# Altium schematic sheet supply_unit.SchDoc: Модуль питания РМ
size 420 x 297 mm; Date: 2019-11-22; ApprovedBy: Мельников; CheckedBy: Соколов; CompanyName: Диаконт; DrawnBy: Тихонов; DocumentNumber: ЭИТЦЯ.436434.018 Э3; Revision: A; SheetTotal: 1; DocumentType: Схема электрическая принципиальная; Liter: Э; PageSetup: Record=PageOptions|CenterHorizontal=True|CenterVertical=True|PrintScale=0.96|XCorrection=1.00|YCorrection=1.00|PrintKind=1|BorderSize=5000000|LeftOffset=0|BottomOffset=0|Orientation=2|PaperLength=1000|PaperWidth=1000|Scale=100|PaperSource=7|PrintQuality=-4|MediaType=1|DitherType=10|PaperKind=A3|PrintScaleMode=1; FirstApp: ЭИТЦЯ.436434.018; Language: en; ResponsibleDept: DED; DocumentStatus: Released; DecimalNumber: {DecimalNumber}
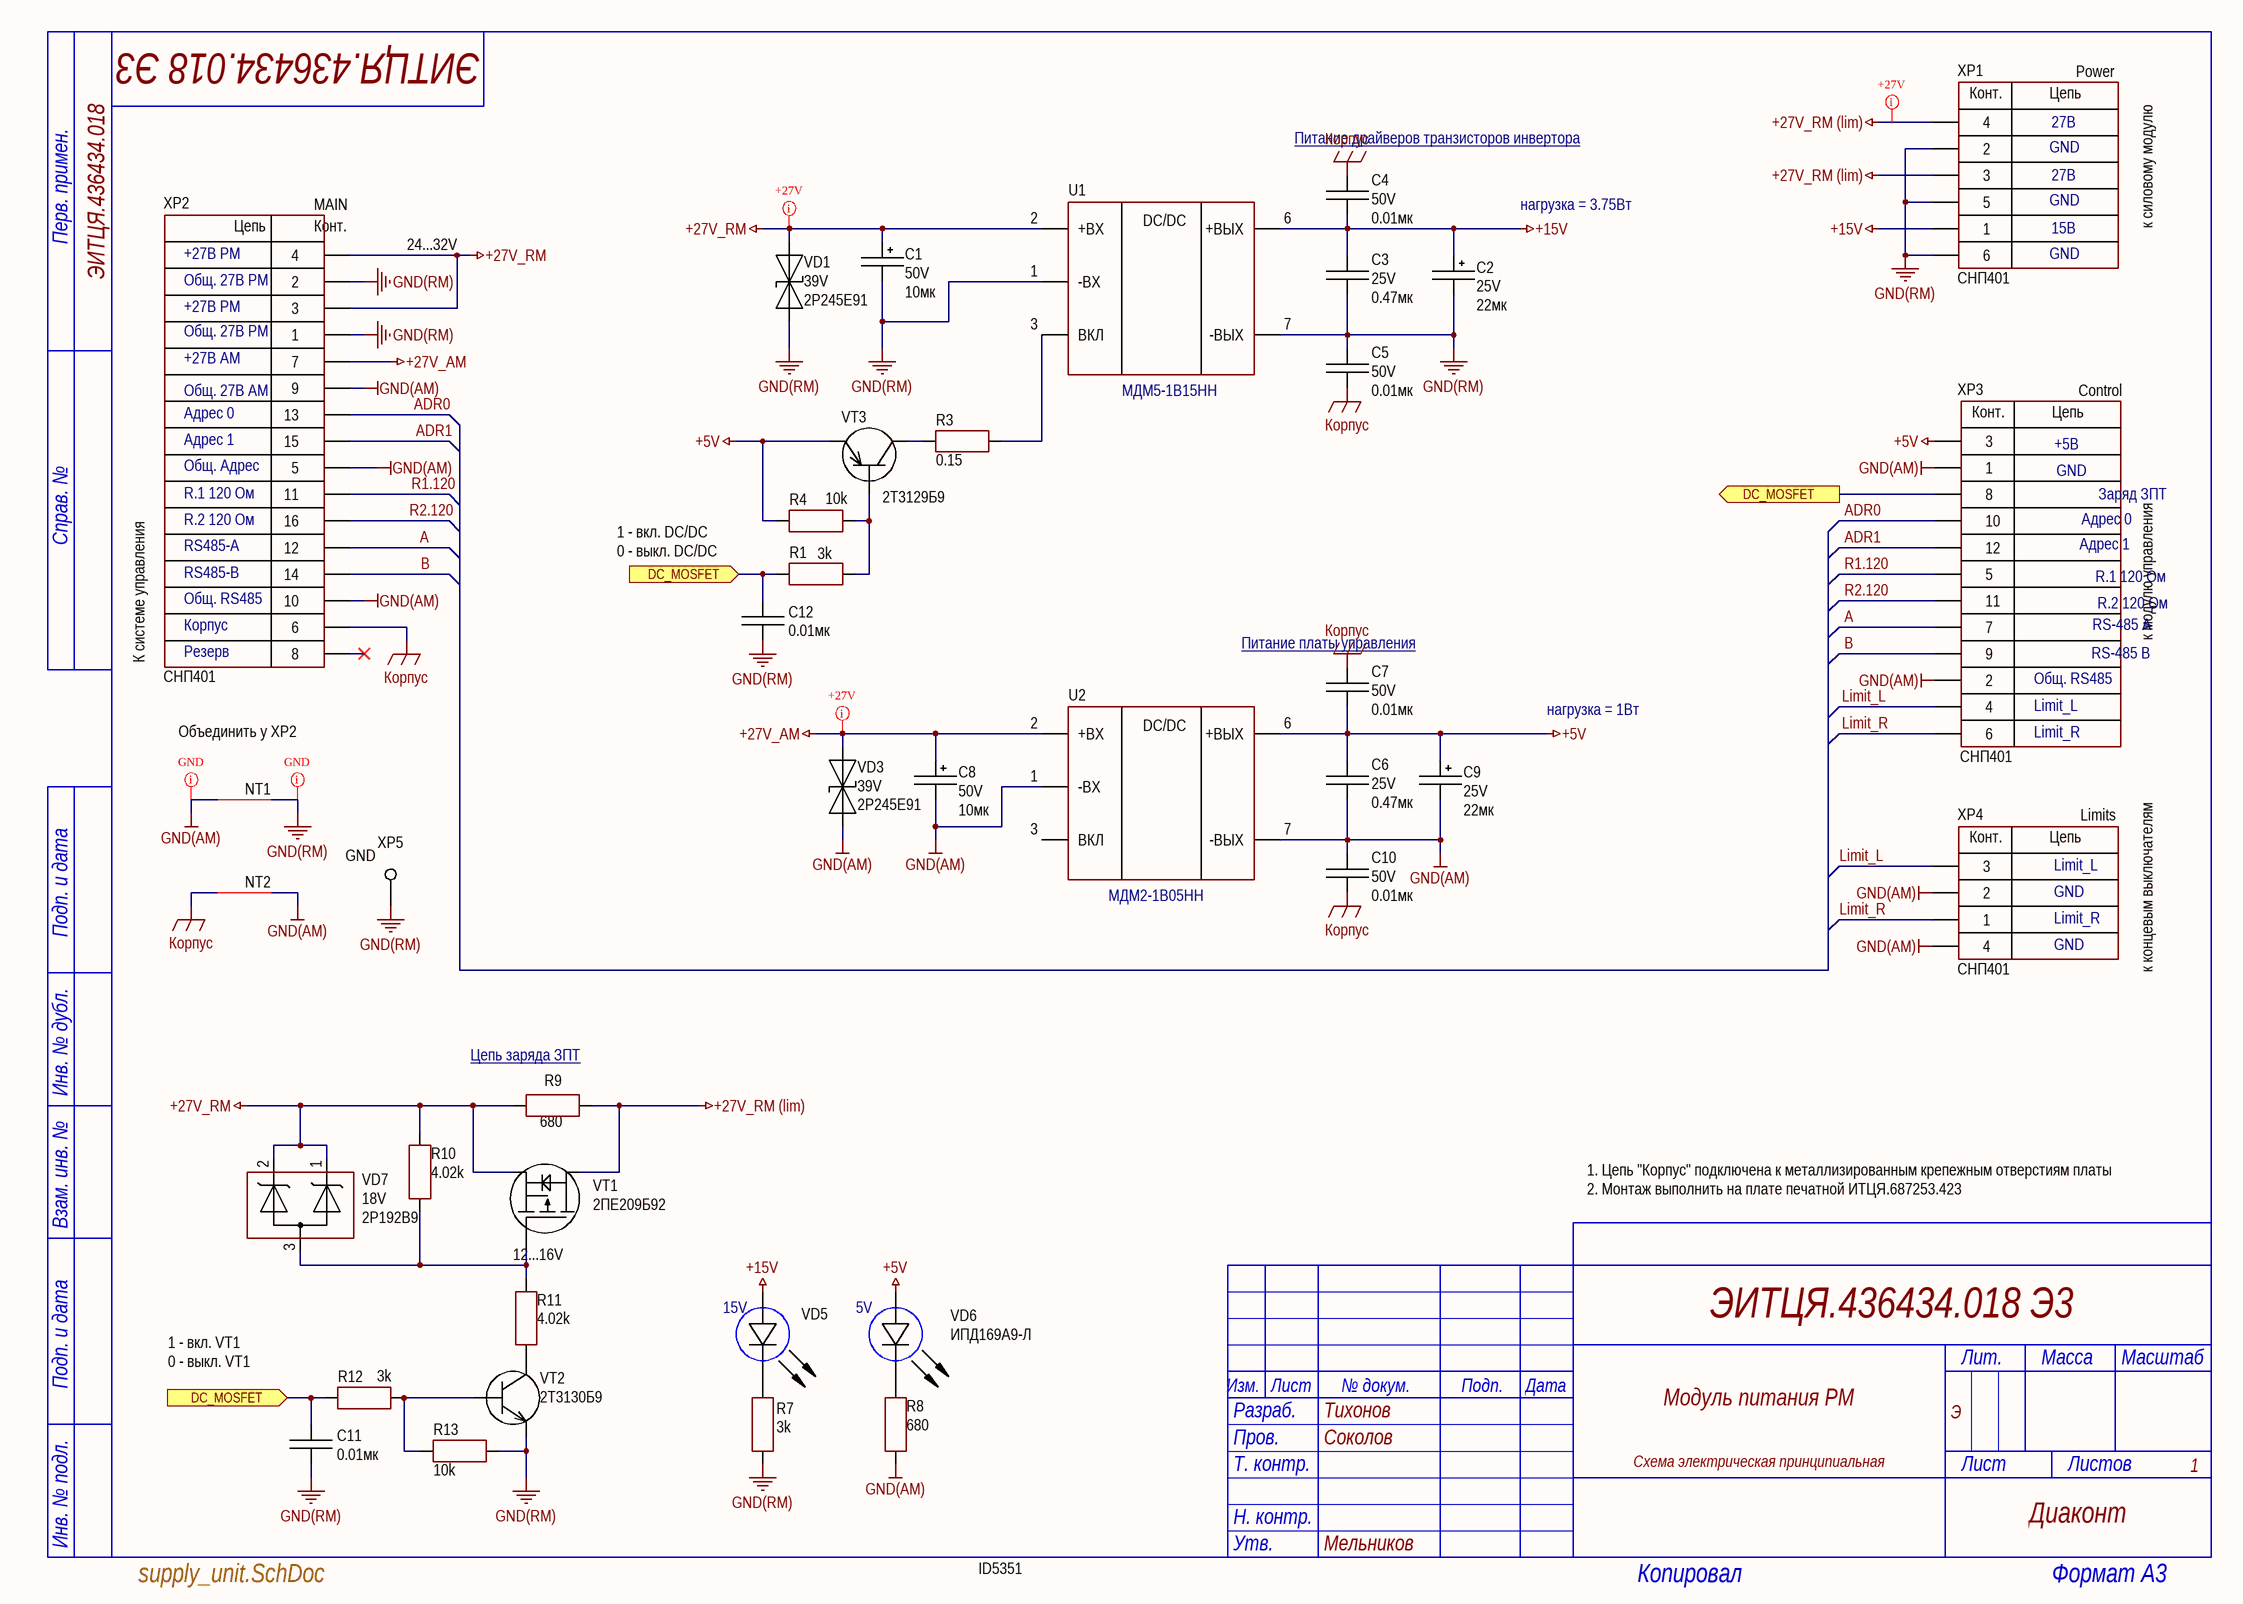
[diagram p0: supply_unit.SchDoc]

## Parts
C1  value 10мк  Voltage: 50V  [CAP: TANTAL-E]  (hidden comment: Tantalum capacitor, 10мк, 50V, ±10%, 0.7 Ом, case E, -60...+125°C)
C2  value 22мк  Voltage: 25V  [CAP: TANTAL-D]  (hidden comment: Tantalum capacitor, 22мк, 25V, ±10%, 0.7 Ом, case D, -60...+125°C)
C3  value 0.47мк  Voltage: 25V  [CAP: 1210]
C4  value 0.01мк  Voltage: 50V  [CAP: 0603]
C5  value 0.01мк  Voltage: 50V  [CAP: 0603]
C6  value 0.47мк  Voltage: 25V  [CAP: 1210]
C7  value 0.01мк  Voltage: 50V  [CAP: 0603]
C8  value 10мк  Voltage: 50V  [CAP: TANTAL-E]  (hidden comment: Tantalum capacitor, 10мк, 50V, ±10%, 0.7 Ом, case E, -60...+125°C)
C9  value 22мк  Voltage: 25V  [CAP: TANTAL-D]  (hidden comment: Tantalum capacitor, 22мк, 25V, ±10%, 0.7 Ом, case D, -60...+125°C)
C10  value 0.01мк  Voltage: 50V  [CAP: 0603]
C11  value 0.01мк  [CAP: 0603P]
C12  value 0.01мк  [CAP: 0603P]
NT1  (no value)  [NetTie_0805]  (net tie, no BOM)
NT2  (no value)  [NetTie_0603]  (net tie, no BOM)
R1  value 3k  [RES: 0603P]
R3  value 0.15  [RES: 0603P]
R4  value 10k  [RES: 0603P]
R7  value 3k  [RES: 0603P]
R8  value 680  [RES: 0603P]
R9  value 680  [RES: 0805P]
R10  value 4.02k  [RES: 0805P]
R11  value 4.02k  [RES: 0805P]
R12  value 3k  [RES: 0603P]
R13  value 10k  [RES: 0603P]
U1  CommentText: МДМ5-1В15НН  [SIP-8]
U2  CommentText: МДМ2-1В05НН  [SIP-8]
VD1  Voltage: 39V  PartNumber: 2Р245Е91  [DIODE: SMB]
VD3  Voltage: 39V  PartNumber: 2Р245Е91  [DIODE: SMB]
VD5  CommentText: 15V  [LED: 0603G]
VD6  PartNumber: ИПД169А9-Л  CommentText: 5V  [LED: 0603G]
VD7  Voltage: 18V  PartNumber: 2Р192В9  [SOT23]
VT1  PartNumber: 2ПЕ209Б92  [DPAK]
VT2  PartNumber: 2Т3130Б9  [SOT23]
VT3  PartNumber: 2Т3129Б9  [SOT23]
XP1  CommentText: СНП401  [CON: M80-5000605]
XP2  CommentText: СНП401  [CON: M80-5001605]
XP3  CommentText: СНП401  [CON: M80-5001205]
XP4  CommentText: СНП401  [CON: M80-5000405]
XP5  GND  [CON: PLS2-1]  (value not drawn)

## Ports
DC_MOSFET (in), DC_MOSFET (out)

## Nets
+5V: C6.2 C7.1 C9.1 R4.1 U2.6(+ВЫХ) VD6.1(A) VT3.2(E) XP3.3
+15V: C2.1 C3.2 C4.1 U1.6(+ВЫХ) VD5.1(A) XP1.1
+27V_AM: C8.1 U2.2(+ВХ) VD3.2(C) XP2.7
+27V_RM: C1.1 R9.1 R10.1 U1.2(+ВХ) VD1.2(C) VD7.1(K1) VD7.2(K2) VT1.2(S) XP2.3 XP2.4
+27V_RM (lim): R9.2 VT1.3(D) XP1.3 XP1.4
GND(AM): C6.1 C8.2 C9.2 C10.2 NT1.1 NT2.2 R8.2 U2.1(-ВХ) U2.7(-ВЫХ) VD3.1(A) XP2.5 XP2.9 XP2.10 XP3.1 XP3.2 XP4.2 XP4.4
GND(RM): C1.2 C2.2 C3.1 C5.2 C11.2 C12.2 NT1.2 R7.1 R13.1 U1.1(-ВХ) U1.7(-ВЫХ) VD1.1(A) VT2.2(E) XP1.2 XP1.5 XP1.6 XP2.1 XP2.2 XP5.1
Корпус: C4.2 C5.1 C7.2 C10.1 NT2.1 XP2.6
A: XP2.12 XP3.7
ADR0: XP2.13 XP3.10
ADR1: XP2.15 XP3.12
B: XP2.14 XP3.9
DC_MOSFET: C11.1 C12.1 R1.2 R12.1 XP3.8 ; port DC_MOSFET
Limit_L: XP3.4 XP4.3
Limit_R: XP3.6 XP4.1
R1.120: XP2.11 XP3.5
R2.120: XP2.16 XP3.11
NetR1_1: R1.1 R4.2 VT3.1(B)
NetR3_1: R3.1 VT3.3(C)
NetR3_2: R3.2 U1.3(ВКЛ)
NetR7_2: R7.2 VD5.2(C)
NetR8_1: R8.1 VD6.2(C)
NetR10_2: R10.2 R11.1 VD7.3(A) VT1.1(G)
NetR11_2: R11.2 VT2.3(C)
NetR12_2: R12.2 R13.2 VT2.1(B)

Not connected (* = marked no-connect by the designer): U2 3(ВКЛ); XP2 8*

## Layout directives
net class +27V: +27V_AM, +27V_RM, +27V_RM (lim)
net class GND: GND(AM), GND(RM)

## Notes on the sheet
- 27В
- Power
- Питание драйверов транзисторов инвертора
- GND
- +27В РМ
- (near XP2) MAIN
- (near XP2) 24...32V
- (near C4) нагрузка = 3.75Вт
- 15В
- к силовому модулю
- (near XP2) Общ. 27В РМ
- (near XP2) Общ. 27В АМ
- +27В АМ
- Control
- Адрес 0
- Адрес 1
- +5В
- К системе управления
- R.1 120 Ом
- R.2 120 Ом
- Общ. Адрес
- Заряд ЗПТ
- RS485-A
- RS485-B
- 1 - вкл. DC/DC
  0 - выкл. DC/DC
- (near XP3) R.1 120 Ом
- Общ. RS485
- Корпус
- Резерв
- Питание платы управления
- RS-485 B
- RS-485 A
- (near XP3) R.2 120 Ом
- к модулю управления
- нагрузка = 1Вт
- Limit_L
- Объединить у XP2
- Limit_R
- (near XP5) GND
- Limits
- к концевым выключателям
- Цепь заряда ЗПТ
- (near VT1) 12...16V
- 1. Цепь "Корпус" подключена к металлизированным крепежным отверстиям платы
  2. Монтаж выполнить на плате печатной ИТЦЯ.687253.423
- 1 - вкл. VT1
  0 - выкл. VT1
- ID5351
- Перв. примен.
- Справ. №
- Подп. и дата
- Инв. № дубл.
- Взам. инв. №
- Изм.
- Лист
- № докум.
- Подп.
- Дата
- Лит.
- Масса
- Масштаб
- Разраб.
- Пров.
- Т. контр.
- Листов
- Инв. № подл.
- Н. контр.
- Утв.
- Копировал
- Формат A3
- (in symbol M80-5000405 Harwin) Конт.; Цепь
- (in symbol M80-5000605 Harwin) Конт.; Цепь
- (in symbol M80-5001205 Harwin) Конт.; Цепь
- (in symbol M80-5001205 Harwin_1) Цепь; Конт.
- (in symbol МДМ3-1В09СН) DC/DC

## Library data of the parts
C1 C8 = Tantal_E: Manufacturer: Элеконд; PartNumber: К53-68 "E"-50 В-10мкф ±10%; Impedance: 0.7 Ом; Analog: 00132739 (pin-to-pin на 15мкФ); MAX: 00145440; Polarity: +; Package: case E; HelpURL: https://eandc.ru/pdf/kondensator/k53-68.pdf; ValueManufacturerPartNumber: Tantalum capacitor, 10мк, 50V, ±10%, 0.7 Ом, case E, -60...+125°C; Temperature: -60...+125°C; Tolerance: ±10%; TypeCapacitor: Tantalum capacitor
C2 C9 = Tantal_D: Manufacturer: Элеконд; PartNumber: К53-68 "D"-25 В-22мкф ±10%; Impedance: 0.7 Ом; MAX: 00132735; Package: case D; HelpURL: https://eandc.ru/pdf/kondensator/k53-68.pdf; ValueManufacturerPartNumber: Tantalum capacitor, 22мк, 25V, ±10%, 0.7 Ом, case D, -60...+125°C; Temperature: -60...+125°C; Tolerance: ±10%; TypeCapacitor: Tantalum capacitor
C3 C6 = Ceramic_0603: Manufacturer: Монолит; PartNumber: К10-84в-3225М-25В-0,47 мкФ ±10%-Н20-N-A; ValueManufacturerPartNumber: Ceramic capacitor, 0.47мк, Н20, ±10%, 25V, 1210 (3225М),; TypeCapacitor: Ceramic capacitor; Tolerance: ±10%; TypeDielectric: Н20; Analog: MAX 00150226; Package: 1210 (3225М); HelpURL: http://www.monolit.vitebsk.by/Files/K10-84.pdf
C4 C5 C7 C10 = Ceramic_0603: Manufacturer: Монолит; PartNumber: К10-84в-1608М-50В-0.01мк ±20%-Н20-N-A; ValueManufacturerPartNumber: Ceramic capacitor, 0.01мк, Н20, ±10%, 50V, 0603 (1608M), -55...+125°C; TypeCapacitor: Ceramic capacitor; Tolerance: ±10%; TypeDielectric: Н20; Package: 0603 (1608M); HelpURL: http://www.monolit.vitebsk.by/Files/K10-84.pdf; Temperature: -55...+125°C
C11 C12 = Ceramic_0603: Manufacturer: Монолит; PartNumber: К10-84в-1608М-50В-0.01мк ±20%-Н20-N-A; ValueManufacturerPartNumber: Ceramic capacitor, 0.01мк, H20, ±20%, 50V, 0603 (1608M), -55...+125°C; TypeCapacitor: Ceramic capacitor; Tolerance: ±20%; TypeDielectric: H20; Voltage: 50V; Analog: MAX 00131676 (pin-to-pin); Package: 0603 (1608M); HelpURL: http://www.monolit.vitebsk.by/Files/K10-84.pdf; Temperature: -55...+125°C
NT1 NT2 = NetTie
R1 R7 R12 = Resistor_0603: Manufacturer: ОАО Ресурс; PartNumber: Р1-12-0,1ум.-3~кОм ±5%-М ШКАБ.434110.002 ТУ; ValueManufacturerPartNumber: Resistor film, 3k, ±1%, 0603, 0.1W, -55...+125°C; TypeResistor: Resistor film; Power: 0.1W; Tolerance: ±1%; MAX: 00134036; Package: 0603; HelpURL: https://aoresurs.com/catalog/chip_rezistory/rezistory-r1-12-kategoriya-kachestva-vp-/; Temperature: -55...+125°C
R3 = Resistor_0603: Manufacturer: ОАО Ресурс; PartNumber: Р1-12-0,1ум.-0.15~Ом ±20%-М ШКАБ.434110.002 ТУ; ValueManufacturerPartNumber: Resistor film, 0.15, ±20%, 0603, 0.1W, -55...+125°C; TypeResistor: Resistor film; Power: 0.1W; Tolerance: ±20%; MAX: 00133968; Analog: MAX 00117169 pin-to-pin; Package: 0603; HelpURL: https://aoresurs.com/catalog/chip_rezistory/rezistory-r1-12-kategoriya-kachestva-vp-/; Temperature: -55...+125°C
R4 R13 = Resistor_0603: Manufacturer: ОАО Ресурс; PartNumber: Р1-12-0,1ум.-10~кОм ±5%-М ШКАБ.434110.002 ТУ; ValueManufacturerPartNumber: Resistor film, 10k, ±5%, 0603, 0.1W, -55...+125°C; TypeResistor: Resistor film; Power: 0.1W; Tolerance: ±5%; MAX: 00133985; Analog: MAX 00133986 (1%); Package: 0603; HelpURL: https://aoresurs.com/catalog/chip_rezistory/rezistory-r1-12-kategoriya-kachestva-vp-/; Temperature: -55...+125°C
R8 = Resistor_0603: Manufacturer: ОАО Ресурс; PartNumber: Р1-12-0,1ум.-680~Ом ±5%-М ШКАБ.434110.002 ТУ; ValueManufacturerPartNumber: Resistor film, 680, ±5%, 0603, 0.1W, -55...+125°C; TypeResistor: Resistor film; Power: 0.1W; Tolerance: ±5%; MAX: 00134086; Package: 0603; HelpURL: https://aoresurs.com/catalog/chip_rezistory/rezistory-r1-12-kategoriya-kachestva-vp-/; Temperature: -55...+125°C
R9 = Resistor_0805: Manufacturer: Ресурс; PartNumber: Р1-12-0,125-680 Ом ±5%-М ШКАБ.434110.002 ТУ; ValueManufacturerPartNumber: Resistor film, 680, ±5%, 0805, 0.125W,; TypeResistor: Resistor film; Power: 0.125W; Tolerance: ±5%; MAX: 00133924; Package: 0805; HelpURL: https://aoresurs.com/catalog/chip_rezistory/rezistory-r1-12-kategoriya-kachestva-vp-/
R10 = Resistor_0603: Manufacturer: ОАО Ресурс; PartNumber: Р1-12-0,1ум.-4.02~кОм ±1%-М ШКАБ.434110.002 ТУ; ValueManufacturerPartNumber: Resistor film, 4.02k, ±1%, 0805, 0.125W, -55...+125°C; TypeResistor: Resistor film; Power: 0.125W; Tolerance: ±1%; MAX: 00123886; Package: 0805; HelpURL: https://aoresurs.com/catalog/chip_rezistory/rezistory-r1-12-kategoriya-kachestva-vp-/; Temperature: -55...+125°C
R11 = Resistor_0603: Manufacturer: ОАО Ресурс; PartNumber: Р1-12-0,1ум.-4.02~кОм ±1%-М ШКАБ.434110.002 ТУ; ValueManufacturerPartNumber: Resistor film, 4.02k, ±1%, 0805, 0.125W, -55...+125°C; TypeResistor: Resistor film; Power: 0.125W; Tolerance: ±1%; Analog: 00123886; Package: 0805; HelpURL: https://aoresurs.com/catalog/chip_rezistory/rezistory-r1-12-kategoriya-kachestva-vp-/; Temperature: -55...+125°C
U1 = МДМ3-1В09СН: DC/DC converter; Manufacturer: Aedon; ValueManufacturerPartNumber: DC/DC converter, isolator, 15V 1.5A, -40...+90°C, SIP-8; PartNumber: МДМ5-1В15НН АНЖЕ.436630.001ТУ; OutputType: isolator; OutputVoltage: 15V 1.5A; Vin: 18-36V; Analog: MAX 00130134; Power: 5W; HelpURL: https://www.aedon.ru/catalog/dcdc/models/96; Package: SIP-8; ComponentType: DC/DC converter; Temperature: -40...+90°C
U2 = МДМ3-1В09СН: DC/DC converter; Manufacturer: Aedon; ValueManufacturerPartNumber: DC/DC converter, isolator, 5V 600mA, -40...+90°C, SIP-8; PartNumber: МДМ2-1В05НН АНЖЕ.436630.001ТУ; OutputType: isolator; OutputVoltage: 5V 600mA; VIN: 18-36V; Analog: MAX 00130811; Power: 2W; HelpURL: https://www.aedon.ru/catalog/dcdc/models/96; Package: SIP-8; ComponentType: DC/DC converter; Temperature: -40...+90°C
VD1 VD3 = TVS_single: Manufacturer: НЗПП; TypeDiode: Zener diode; Current: 8A; VoltageDrop: 0.9V; Analog: SMA6J33A; Package: SMB(КД-42); HelpURL: http://www.nzpp.ru/product/; ValueManufacturerPartNumber: =TypeDiode+', '+Voltage+', '+Current+', '+VoltageDrop+', '+RecoveryTime+', '+Package+', '+Temperature
VD5 = LED_single: Manufacturer: Протон; ValueManufacturerPartNumber: LED, 20mA max, 1.9V@4mA, 1608, -55...+150°C; PartNumber: ИПД169А9-Л; TypeDiode: LED; Current: 20mA max; VoltageDrop: 1.9V@4mA; Color: GREEN; Analog: MAX 00129484 КР-1608 Kingbright (pin-to-pin); Package: 1608; HelpURL: *; Temperature: -55...+150°C
VD6 = LED_single: Manufacturer: Протон; ValueManufacturerPartNumber: LED, 20mA max, 1.9V@4mA, 1608, -55...+150°C; TypeDiode: LED; Current: 20mA max; VoltageDrop: 1.9V@4mA; Color: GREEN; Analog: MAX 00129484 КР-1608 Kingbright (pin-to-pin); Package: 1608; HelpURL: *; Temperature: -55...+150°C
VD7 = TVS_array_var2: Manufacturer: КРИП; TypeDiode: TVS diode; Current: 1A; Uогр.: 22.5V; Cap: 21pF; NOTE: указано для pin1-pin3; Analog: КР192А9 (ОТК) (pin-to-pin); Package: SOT-23; ValueManufacturerPartNumber: =TypeDiode+', '+Voltage+', '+Current+', '+VoltageDrop+', '+RecoveryTime+', '+Package+', '+Temperature; Temperature: -55...+150°C
VT1 = MOSFET_P_132: Manufacturer: Ангстрем; ValueManufacturerPartNumber: MOSFET P-channel transistor, 60V, 22A, 2.9nC, 2.5W, 40mOhm, 220pF, KT-89 (DPAK/TO-252), -55...+150°C; TypeTransistor: MOSFET P-channel transistor; VoltageDS: 60V; CurrentDS: 22A; RDS: 40mOhm; GateCharge: 2.9nC; InputCapacitor: 220pF; MaxPower: 2.5W; Analog: SUD50P06-15 (pin-to-pin); Package: KT-89 (DPAK/TO-252); HelpURL: https://www.vishay.com/docs/68940/sud50p06-15.pdf; Temperature: -55...+150°C
VT2 = BJT_NPN_132: Manufacturer: ООО НПК Далекс; ValueManufacturerPartNumber: NPN transistor, 30V, 100mA, , 300mW, 0.7V, 500, SOT-23 (КТ-46), -55...+125°C; TypeTransistor: NPN transistor; VoltageCE: 30V; CurrentCE: 100mA; VoltageSaturation: 0.7V; CurrentGain: 500; MaxPower: 300mW; MAX: 00123842; Package: SOT-23 (КТ-46); HelpURL: http://www.radioman-portal.ru/sprav/pp/transisters/sourse/2t3130.pdf; Temperature: -55...+125°C
VT3 = BJT_PNP_123: ValueManufacturerPartNumber: NPN transistor, 40V, 100mA, , 200mW, 1.3V, 220, SOT-23 (КТ-46),; TypeTransistor: NPN transistor; VoltageCE: 40V; CurrentCE: 100mA; VoltageSaturation: 1.3V; CurrentGain: 220; MaxPower: 200mW; MAX: 00123135; Package: SOT-23 (КТ-46); HelpURL: https://eandc.ru/pdf/tranzistor/2t3129_kt3129.pdf
XP1 = M80-5000605 Harwin: вилка на плату; Manufacturer: Электроделать; ValueManufacturerPartNumber: Вилка, 6pin, 2mm, 120VAC, 1.5A; PartNumber: СНП401-6ВП21-3-1-1; VoltageMax: 120VAC; Pitch: 2mm; CurrentMax: 1.5A; Multichannel: 6pin; Analog: MAX 00126397 (M80-5000605 pin-to-pin); HelpURL: https://eu.mouser.com/ProductDetail/Harwin/M80-5000605?qs=yQtJ9TWM%2F1KaJIUUBEXorg%3D%3D; TypeConnector: Вилка
XP2 = M80-5001205 Harwin_1: вилка на плату; Manufacturer: Электродеталь; ValueManufacturerPartNumber: , 16pin, 2mm, 120VAC, 1.5A; PartNumber: СНП401-16ВП21-3-1-1; VoltageMax: 120VAC; Pitch: 2mm; CurrentMax: 1.5A; Multichannel: 16pin; Analog: MAX 00139241 [М80-5101605] (pin-to-pin); HelpURL: https://www.digikey.com/product-detail/en/harwin-inc/M80-5001605/952-2626-ND/5175716
XP3 = M80-5001205 Harwin: вилка на плату; Manufacturer: Электродеталь; ValueManufacturerPartNumber: Вилка, 12pin, 2mm, 100V, 1.5A; PartNumber: СНП401-12ВП21-3-1-1; VoltageMax: 100V; Pitch: 2mm; CurrentMax: 1.5A; Multichannel: 12pin; Analog: MAX 00138662 (M80-5101205 pin-to-pin); HelpURL: https://eu.mouser.com/ProductDetail/Harwin/M80-5001205?qs=yQtJ9TWM%2F1IJJSuF%2FTVm0Q==; TypeConnector: Вилка
XP4 = M80-5000405 Harwin: вилка на плату; Manufacturer: Электродеталь; ValueManufacturerPartNumber: Вилка, 4pin, 2mm, 120VAC, 1.5A; PartNumber: СНП401-4ВП21-3-1-1; VoltageMax: 120VAC; Pitch: 2mm; CurrentMax: 1.5A; Multichannel: 4pin; Analog: MAX 00138661; HelpURL: https://eu.mouser.com/ProductDetail/Harwin/M80-5000405?qs=yQtJ9TWM%2F1IJnFqYnM2R9Q%3D%3D; TypeConnector: Вилка
XP5 = PLS2-1: Test probe; PartNumber: СНП377-1ВП21-1; Manufacturer: Электродеталь; Tolerance: СНП377; MAX: 00130069; Шаг: 2mm; Analog: PLS2-1; MAX: *; Publisher: TEN; Published: 2019; Type: Control pin; HelpURL: https://www.elektrodetal.com/catalog/snp377/